# EAGLE design ESPDHTNode (EAGLE 7.7.0)
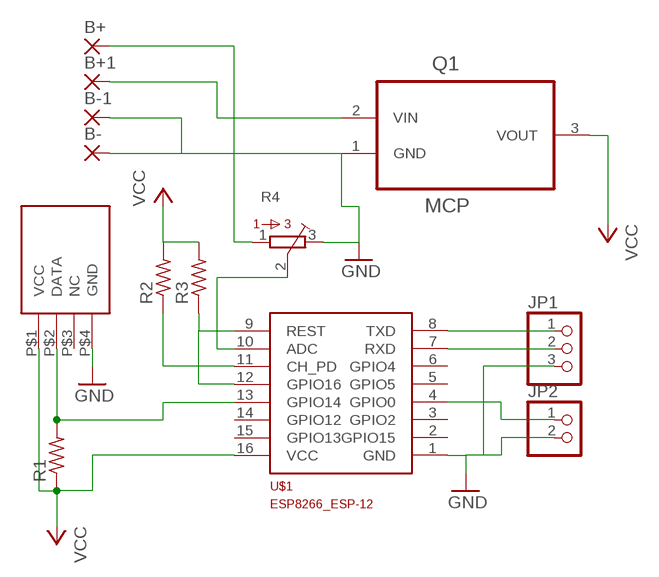
[diagram p0: schematic, sheet 1]

## Parts
B+  WIREPAD2,54/0,8  [2,54/0,8]
B+1  WIREPAD2,54/0,8  [2,54/0,8]
B-  WIREPAD2,54/0,8  [2,54/0,8]
B-1  WIREPAD2,54/0,8  [2,54/0,8]
JP1  PINHD-1X3  [1X03]
JP2  PINHD-1X2  [1X02]
Q1  MCP  MCP1702-3302E/TO  [TO127P254X533-3]
R1  R-US_0207/10  [0207/10]
R2  R-US_0207/10  [0207/10]
R3  R-US_0207/10  [0207/10]
R4  3362P  [3362P]
U$1  ESP8266_ESP-12  [ESP8266-ESP12]
U$2  DHTDHT11  [DHT]

## Nets
GND: B-1.1(P) B-.1(P) JP1.3 JP2.2 Q1.1(GND) R4.3 U$1.1(GND) U$2.P$4(GND)
N$1: R1.2 U$1.13(GPIO14) U$2.P$2(DATA)
N$2: JP1.1 U$1.8(TXD)
N$3: JP1.2 U$1.7(RXD)
N$4: R3.1 U$1.9(REST) U$1.12(GPIO16)
N$5: R2.1 U$1.11(CH_PD)
N$6: B+1.1(P) B+.1(P) Q1.2(VIN) R4.1
N$8: JP2.1 U$1.4(GPIO0)
N$11: R4.2 U$1.10(ADC)
VCC: Q1.3(VOUT) R1.1 R2.2 R3.2 U$1.16(VCC) U$2.P$1(VCC)
Unconnected: U$1.2(GPIO15) U$1.3(GPIO2) U$1.5(GPIO5) U$1.6(GPIO4) U$1.14(GPIO12) U$1.15(GPIO13) U$2.P$3(NC)

## Library data of the parts
B+ B+1 B- B-1 = wirepad:WIREPAD: Wire PAD connect wire on PCB
JP1 = pinhead:PINHD-1X3: PIN HEADER
JP2 = pinhead:PINHD-1X2: PIN HEADER
Q1 = Microchip_By_element14_Batch_1:MCP1702-3302E/TO: IC, V REG, LDO, 250MA; MPN: MCP1702-3302E/TO; OC_FARNELL: 1331485; OC_NEWARK: 34M7419; PACKAGE: TO-92; SUPPLIER: Microchip
R1-R3 = rcl:R-US_: RESISTOR, American symbol
R4 = bourns:3362: 3362 Series 1/4" Square Trimmer
U$1 = ESP8266-ESP12:ESP8266_ESP-12
U$2 = DHT:DHT

## Board
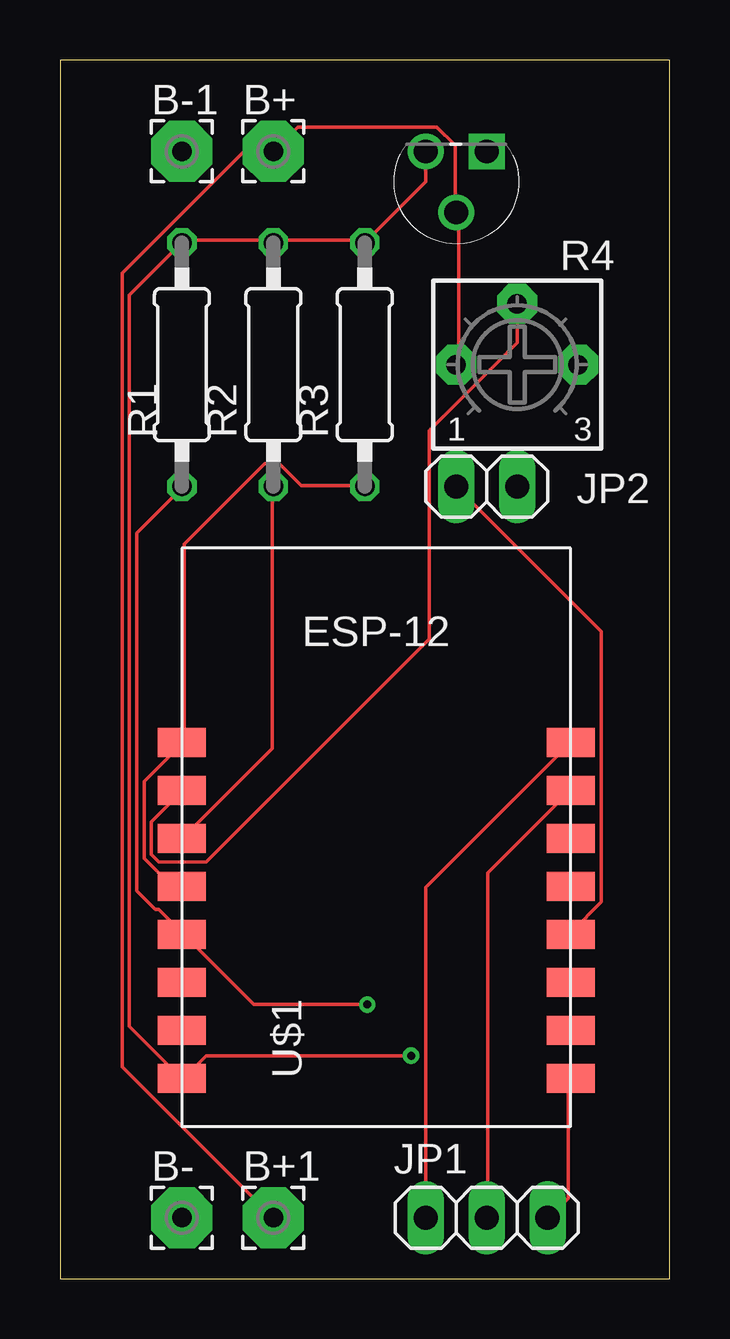
[diagram p1: board, top side]
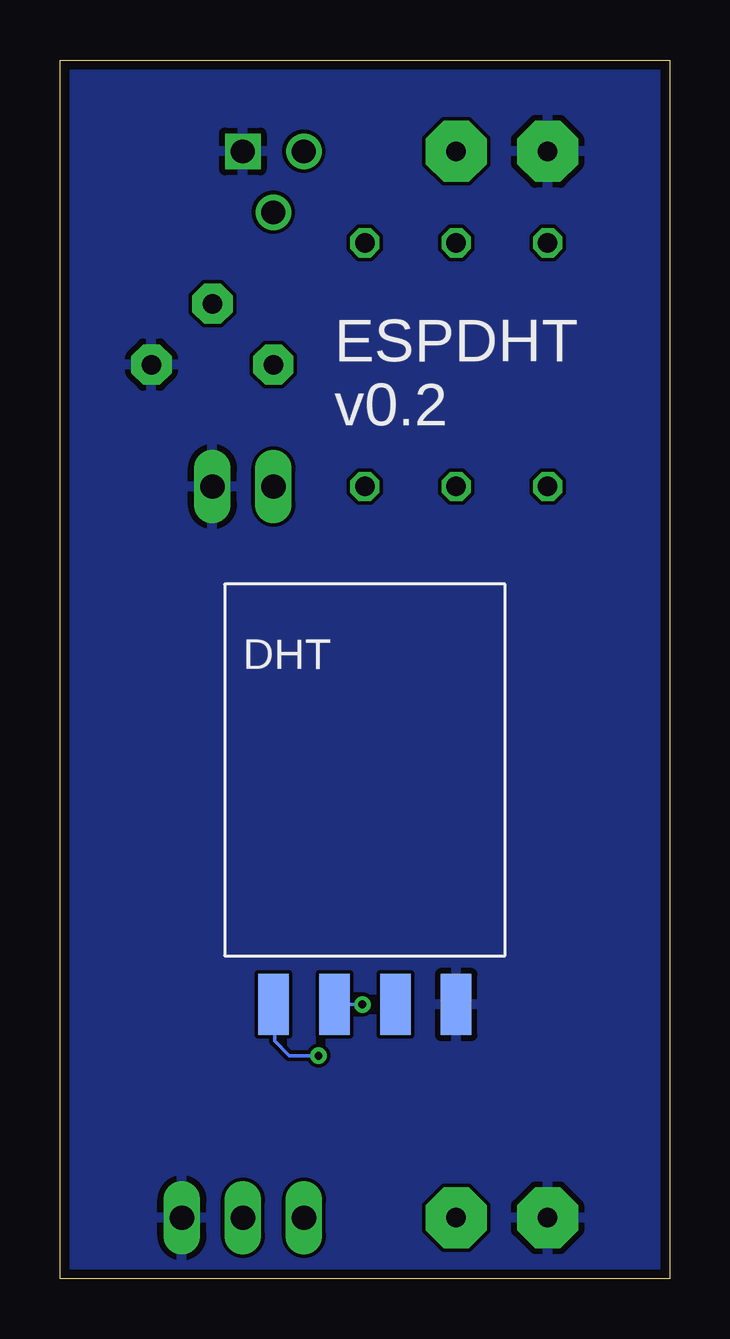
[diagram p2: board, bottom side, seen from below]

Size 25.4 x 50.8 mm. Coordinates in mm from the lower left corner, seen from the top.
Outline: 0,0 25.4,0 25.4,50.8 0,50.8 0,0
Copper layers (1*16): Top 0.0356mm / dielectric 1.5011mm / Bottom 0.0356mm
Design rules "LaenPCBOrder": minimum track width 6mil, minimum drill 13mil, track to track 6mil, track to pad 6mil, pad to pad 6mil, via to via 6mil, smd to smd 6mil, copper to edge 15mil, drill to drill 6mil, minimum pad ring 7mil, minimum via ring 7mil, stop-mask expansion 3mil, vias tented up to drill 0mil, thermal gap 10mil

### Footprints (pad centres in the part's own frame; a part is rotated, then mirrored left to right if it is on the bottom)
2,54/0,8 = drill 0.813 pad 2.54 octagon: 1 0,0
1X03 = drill 1.016 long: 1 -2.54,0; 2 0,0; 3 2.54,0
1X02 = drill 1.016 long: 1 -1.27,0; 2 1.27,0
TO127P254X533-3 = drill 0.991 square: 1 -2.54,-2.54 | drill 0.991: 2 -1.27,0; 3 0,-2.54
0207/10 = drill 0.813 octagon: 1 -5.08,0; 2 5.08,0
3362P = drill 0.813 pad 1.676 octagon: 1 -2.54,0; 2 0,2.54; 3 2.54,0
ESP8266-ESP12 = smd 2 x 1.2: 1 16.2,2; 2 16.2,4; 3 16.2,6; 4 16.2,8; 5 16.2,10; 6 16.2,12; 7 16.2,14; 8 16.2,16; 9 0,16; 10 0,14; 11 0,12; 12 0,10; 13 0,8; 14 0,6; 15 0,4; 16 0,2
DHT = smd 1.27 x 2.54: P$1 0,0; P$2 2.54,0; P$3 5.08,0; P$4 7.62,0

### Placement (x,y rotation side)
B+  8.89,46.99 0 top
B+1  8.89,2.54 0 top
B-  5.08,2.54 0 top
B-1  5.08,46.99 0 top
JP1  17.78,2.54 0 top
JP2  17.78,33.02 0 top
Q1  15.24,44.45 180 top
R1  5.08,38.1 270 top
R2  8.89,38.1 90 top
R3  12.7,38.1 90 top
R4  19.05,38.1 0 top
U$1  5.08,6.35 0 top
U$2  16.51,11.43 0 bottom

### Tracks (layer width: path | path; a pad name or v marks a point on that pad's centre or on a via)
GND
  Top 0.152: U$1.1 21.18,8.23 21.18,3.35 20.42,2.59 JP1.3
  pour Bottom: 0,52.07 25.4,52.07 25.4,-1.27 0,-1.27
N$1  (via drill 0.33)
  Top 0.152: R1.2 5.03,32.92 3.2,31.09 3.2,16.15 3.96,15.39 4.12,15.39 5.03,14.48 U$1.13 5.18,14.33 8.08,11.43 v12.8,11.43
  Bottom 0.152: v12.8,11.43 U$2.P$2
N$2
  Top 0.152: JP1.1 15.24,16.31 21.18,22.25 U$1.8
N$3
  Top 0.152: U$1.7 21.18,20.27 17.83,16.92 17.83,2.59 JP1.2
N$4
  Top 0.152: U$1.12 5.03,16.46 4.57,16.46 3.5,17.53 3.5,20.73 5.03,22.25 U$1.9 5.18,22.4 5.18,30.63 8.53,33.98 9.14,33.98 10.06,33.07 12.65,33.07 R3.1
N$5
  Top 0.152: U$1.11 5.18,18.44 8.84,22.1 8.84,32.92 R2.1
N$6
  Top 0.152: R4.1 16.61,38.1 16.61,44.35 Q1.2 16.46,44.5 16.46,47.24 15.7,48.01 9.91,48.01 B+.1 8.84,46.94 7.62,46.94 2.59,41.91 2.59,8.84 B+1.1
N$8
  Top 0.152: JP2.1 22.55,26.98 22.55,15.7 21.34,14.48 U$1.4
N$11
  Top 0.152: R4.2 19.05,39.01 15.39,35.36 15.39,26.67 6.1,17.37 4.12,17.37 3.81,17.68 3.81,19.05 5.03,20.27 U$1.10
VCC  (via drill 0.33)
  Top 0.152: Q1.3 15.24,45.72 R3.2 12.65,43.28 8.99,43.28 R2.2 8.84,43.28 5.18,43.28 R1.1 2.9,41 2.9,10.52 5.03,8.38 U$1.16 5.18,8.38 6.1,9.3 v14.63,9.3
  Bottom 0.152: v14.63,9.3 15.85,9.3 16.46,9.91 16.46,11.43 U$2.P$1

### Text on the board
bPlace: ESPDHT / v0.2